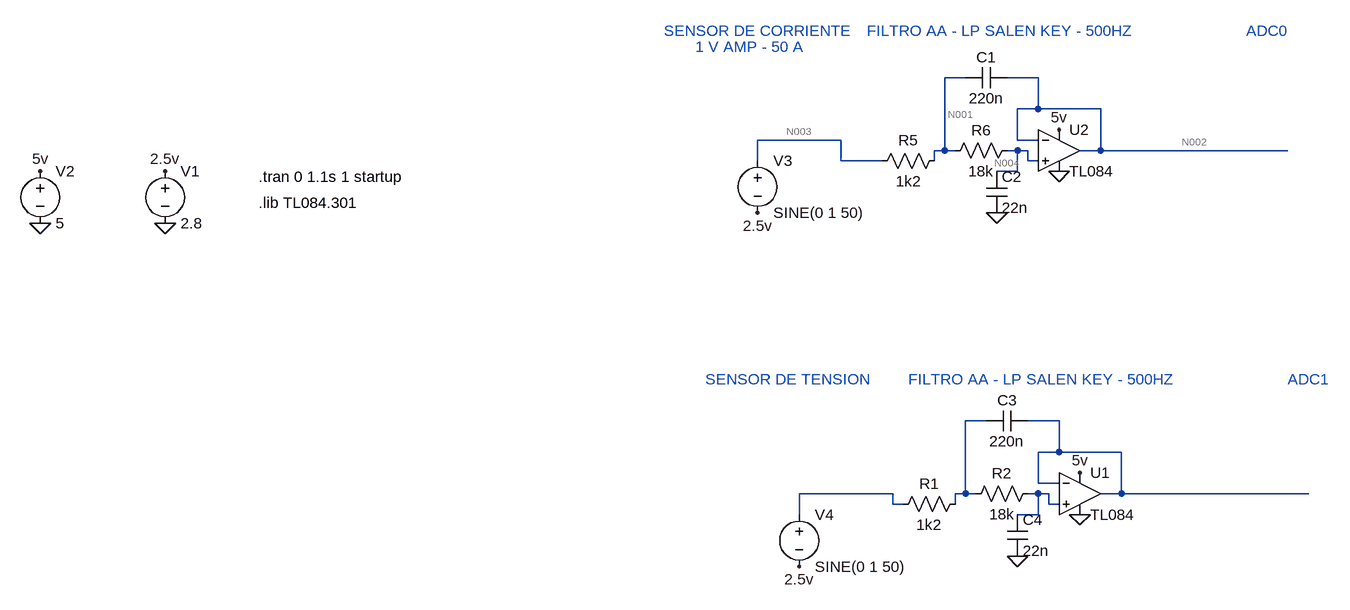
[diagram p0: schematic sim.asc]
sim.asc, the LTspice schematic file:
Version 4
SHEET 1 1300 680
WIRE 288 -416 256 -416
WIRE 400 -416 352 -416
WIRE 400 -368 400 -416
WIRE 400 -368 368 -368
WIRE 496 -368 400 -368
WIRE 96 -320 -32 -320
WIRE 368 -320 368 -368
WIRE 400 -320 368 -320
WIRE 256 -304 256 -416
WIRE 256 -304 240 -304
WIRE 272 -304 256 -304
WIRE 368 -304 352 -304
WIRE 384 -304 368 -304
WIRE 496 -304 496 -368
WIRE 496 -304 464 -304
WIRE 784 -304 496 -304
WIRE -32 -288 -32 -320
WIRE 96 -288 96 -320
WIRE 160 -288 96 -288
WIRE 240 -288 240 -304
WIRE 384 -288 384 -304
WIRE 400 -288 384 -288
WIRE 368 -272 368 -304
WIRE 368 -272 336 -272
WIRE 320 112 288 112
WIRE 432 112 384 112
WIRE 432 160 432 112
WIRE 432 160 400 160
WIRE 528 160 432 160
WIRE 400 208 400 160
WIRE 432 208 400 208
WIRE 176 224 32 224
WIRE 288 224 288 112
WIRE 288 224 272 224
WIRE 304 224 288 224
WIRE 400 224 384 224
WIRE 416 224 400 224
WIRE 528 224 528 160
WIRE 528 224 496 224
WIRE 816 224 528 224
WIRE 176 240 176 224
WIRE 192 240 176 240
WIRE 272 240 272 224
WIRE 416 240 416 224
WIRE 432 240 416 240
WIRE 32 256 32 224
WIRE 400 256 400 224
WIRE 400 256 368 256
FLAG 432 -272 0
FLAG 336 -208 0
FLAG -1136 -192 0
FLAG -1136 -272 5v
FLAG 432 -336 5v
FLAG -944 -192 0
FLAG -944 -272 2.5v
FLAG -32 -208 2.5v
FLAG 464 256 0
FLAG 368 320 0
FLAG 464 192 5v
FLAG 32 336 2.5v
SYMBOL Opamps\\opamp2 432 -368 R0
SYMATTR InstName U2
SYMATTR Value TL084
SYMBOL cap 352 -432 R90
WINDOW 0 0 32 VBottom 2
WINDOW 3 32 32 VTop 2
SYMATTR InstName C1
SYMATTR Value 220n
SYMBOL cap 320 -272 R0
SYMATTR InstName C2
SYMATTR Value 22n
SYMBOL res 256 -304 R90
WINDOW 0 0 56 VBottom 2
WINDOW 3 32 56 VTop 2
SYMATTR InstName R5
SYMATTR Value 1k2
SYMBOL res 368 -320 R90
WINDOW 0 0 56 VBottom 2
WINDOW 3 32 56 VTop 2
SYMATTR InstName R6
SYMATTR Value 18k
SYMBOL voltage -1136 -288 R0
WINDOW 123 0 0 Left 0
WINDOW 39 0 0 Left 0
SYMATTR InstName V2
SYMATTR Value 5
SYMBOL voltage -944 -288 R0
WINDOW 123 0 0 Left 0
WINDOW 39 0 0 Left 0
SYMATTR InstName V1
SYMATTR Value 2.8
SYMBOL voltage -32 -304 R0
WINDOW 123 0 0 Left 0
WINDOW 39 0 0 Left 0
SYMATTR InstName V3
SYMATTR Value SINE(0 1 50)
SYMBOL Opamps\\opamp2 464 160 R0
SYMATTR InstName U1
SYMATTR Value TL084
SYMBOL cap 384 96 R90
WINDOW 0 0 32 VBottom 2
WINDOW 3 32 32 VTop 2
SYMATTR InstName C3
SYMATTR Value 220n
SYMBOL cap 352 256 R0
SYMATTR InstName C4
SYMATTR Value 22n
SYMBOL res 288 224 R90
WINDOW 0 0 56 VBottom 2
WINDOW 3 32 56 VTop 2
SYMATTR InstName R1
SYMATTR Value 1k2
SYMBOL res 400 208 R90
WINDOW 0 0 56 VBottom 2
WINDOW 3 32 56 VTop 2
SYMATTR InstName R2
SYMATTR Value 18k
SYMBOL voltage 32 240 R0
WINDOW 123 0 0 Left 0
WINDOW 39 0 0 Left 0
SYMATTR InstName V4
SYMATTR Value SINE(0 1 50)
TEXT -800 -264 Left 2 !.tran 0 1.1s 1 startup
TEXT -800 -224 Left 2 !.lib TL084.301
TEXT 136 -488 Left 2 ;FILTRO AA - LP SALEN KEY - 500HZ
TEXT 720 -488 Left 2 ;ADC0
TEXT -176 -488 Left 2 ;SENSOR DE CORRIENTE
TEXT -128 -464 Left 2 ;1 V AMP - 50 A
TEXT 200 48 Left 2 ;FILTRO AA - LP SALEN KEY - 500HZ
TEXT 784 48 Left 2 ;ADC1
TEXT -112 48 Left 2 ;SENSOR DE TENSION

The netlist it stands for:
* sim.asc
XU2 N004 N002 5v 0 N002 TL084  ; pins In+ In- V+ V- OUT
C1 N002 N001 220n
C2 N004 0 22n
R5 N001 N003 1k2
R6 N004 N001 18k
V2 5v 0 5
V1 2.5v 0 2.8
V3 N003 2.5v SINE(0 1 50)
XU1 N008 N006 5v 0 N006 TL084  ; pins In+ In- V+ V- OUT
C3 N006 N005 220n
C4 N008 0 22n
R1 N005 N007 1k2
R2 N008 N005 18k
V4 N007 2.5v SINE(0 1 50)
.tran 0 1.1s 1 startup
.lib TL084.301
* FILTRO AA - LP SALEN KEY - 500HZ
* ADC0
* SENSOR DE CORRIENTE
* 1 V AMP - 50 A
* FILTRO AA - LP SALEN KEY - 500HZ
* ADC1
* SENSOR DE TENSION
.backanno
.end

* Results of the author's LTspice run, read from the files saved beside the schematic
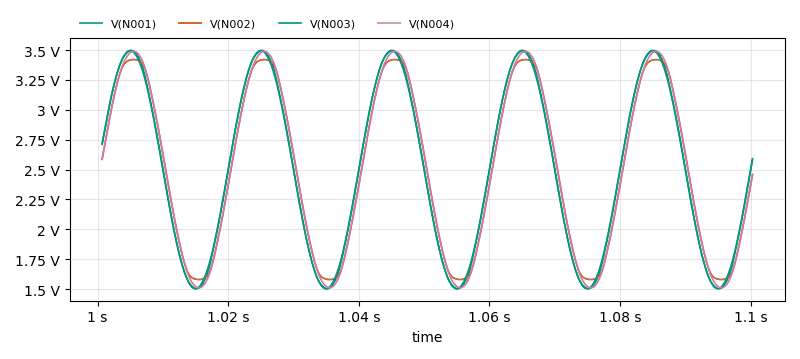
[diagram p1: Transient Analysis of sim.asc, plotted from the saved traces]
* Transient Analysis, 1 run:
*   V(N001): min 1.502 V, max 3.497 V, average 2.499 V, rms 2.599 V, last 2.583 V
*   V(N002): min 1.579 V, max 3.421 V, average 2.5 V, rms 2.592 V, last 2.458 V
*   V(N003): min 1.502 V, max 3.498 V, average 2.499 V, rms 2.597 V, last 2.592 V
*   V(N004): min 1.51 V, max 3.49 V, average 2.5 V, rms 2.598 V, last 2.458 V